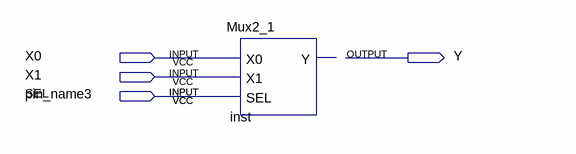
[diagram p0: schematic sheet]
// Quartus schematic MuxDemo.bdf as structural Verilog: 1 symbols, 5 pins
module MuxDemo (
  input  X0,
  input  X1,
  input  pin_name3,
  input  SEL,
  output Y
);

  Mux2_1 inst (.X0(X0), .X1(X1), .SEL(pin_name3));  // open: Y

  assign SEL = pin_name3;
endmodule
